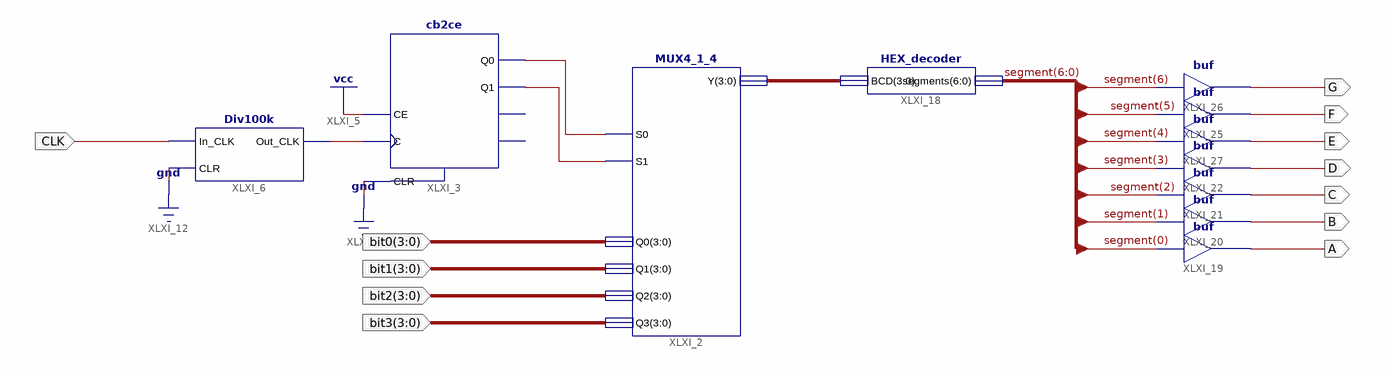
[diagram p0: schematic sheet 1]
// Xilinx ISE schematic displayer.sch (spartan6) as structural Verilog: 11 symbols, 12 ports
module displayer (
  input  [3:0] bit0,
  input  [3:0] bit1,
  input  [3:0] bit2,
  input  [3:0] bit3,
  input  CLK,
  output G,
  output F,
  output A,
  output B,
  output C,
  output D,
  output E
);

  wire XLXN_5, XLXN_6, XLXN_10;
  wire [3:0] XLXN_21;
  wire [6:0] segment;

  MUX4_1_4 XLXI_2 (.Q0(bit0), .Q1(bit1), .S0(XLXN_5), .S1(XLXN_6), .Q2(bit2), .Q3(bit3), .Y(XLXN_21));
  cb2ce XLXI_3 (.C(XLXN_10), .CE(1'b1), .CLR(1'b0), .Q0(XLXN_5), .Q1(XLXN_6));  // open: CEO, TC
  Div100k XLXI_6 (.In_CLK(CLK), .CLR(1'b0), .Out_CLK(XLXN_10));
  HEX_decoder XLXI_18 (.BCD(XLXN_21), .segments(segment));
  buf XLXI_19 (A, segment[0]);
  buf XLXI_20 (B, segment[1]);
  buf XLXI_21 (C, segment[2]);
  buf XLXI_22 (D, segment[3]);
  buf XLXI_25 (F, segment[5]);
  buf XLXI_26 (G, segment[6]);
  buf XLXI_27 (E, segment[4]);
endmodule
